# Altium schematic sheet GateDriver.SchDoc
size A4; SheetNumber: 2; SheetTotal: 3
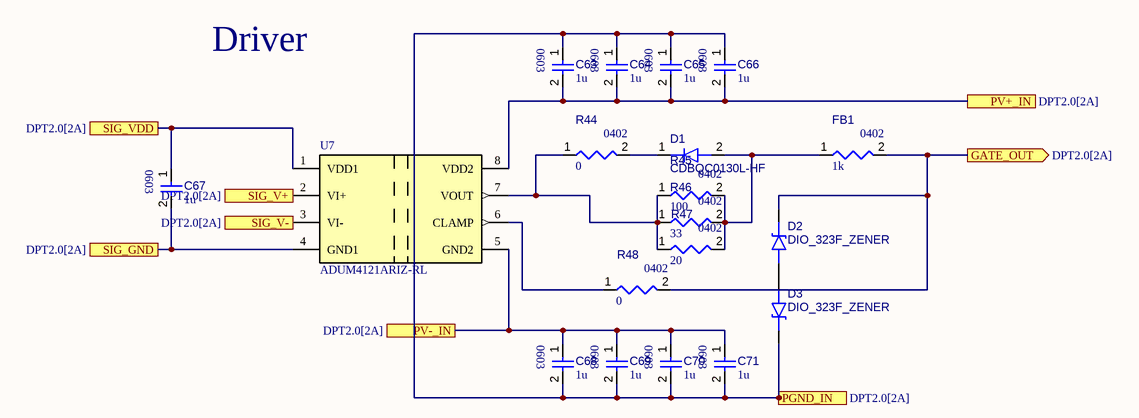
[diagram p0: GateDriver.SchDoc]

## Parts
C63  value 1u  [CAP_0603_HIGH]  (hidden comment: CAP-0603)
C64  value 1u  [CAP_0603_HIGH]  (hidden comment: CAP-0603)
C65  value 1u  [CAP_0603_HIGH]  (hidden comment: CAP-0603)
C66  value 1u  [CAP_0603_HIGH]  (hidden comment: CAP-0603)
C67  value 1u  [CAP_0603_HIGH]  (hidden comment: CAP-0603)
C68  value 1u  [CAP_0603_HIGH]  (hidden comment: CAP-0603)
C69  value 1u  [CAP_0603_HIGH]  (hidden comment: CAP-0603)
C70  value 1u  [CAP_0603_HIGH]  (hidden comment: CAP-0603)
C71  value 1u  [CAP_0603_HIGH]  (hidden comment: CAP-0603)
D1  CDBQC0130L-HF  [DIO_SOD-923F]
D2  DIO_323F_ZENER  [DIO_SOD-323F]
D3  DIO_323F_ZENER  [DIO_SOD-323F]
FB1  value 1k  [RES_0402_HIGH]  (hidden comment: RES-0402)
R44  value 0  [RES_0402_HIGH]  (hidden comment: RES-0402)
R45  value 100  [RES_0402_HIGH]  (hidden comment: RES-0402)
R46  value 33  [RES_0402_HIGH]  (hidden comment: RES-0402)
R47  value 20  [RES_0402_HIGH]  (hidden comment: RES-0402)
R48  value 0  [RES_0402_HIGH]  (hidden comment: RES-0402)
U7  ADUM4121ARIZ-RL  [SOIC-8_WIDE]

## Ports
GATE_OUT (out, see DPT2.0[2A]), PGND_IN (see DPT2.0[2A]), PV+_IN (see DPT2.0[2A]), PV-_IN (see DPT2.0[2A]), SIG_GND (see DPT2.0[2A]), SIG_V+ (in, see DPT2.0[2A]), SIG_V- (in, see DPT2.0[2A]), SIG_VDD (see DPT2.0[2A])

## Nets
GATE_OUT: D2.1(K) FB1.2 R48.2 ; port GATE_OUT
PGND_IN: C63.1 C64.1 C65.1 C66.1 C68.2 C69.2 C70.2 C71.2 D3.1(K) ; port PGND_IN
PV+_IN: C63.2 C64.2 C65.2 C66.2 U7.8(VDD2) ; port PV+_IN
PV-_IN: C68.1 C69.1 C70.1 C71.1 U7.5(GND2) ; port PV-_IN
SIG_GND: C67.2 U7.4(GND1) ; port SIG_GND
SIG_V+: U7.2(VI+) ; port SIG_V+
SIG_V-: U7.3(VI-) ; port SIG_V-
SIG_VDD: C67.1 U7.1(VDD1) ; port SIG_VDD
NetD1_1: D1.1(K) R44.2
NetD1_2: D1.2(A) FB1.1 R45.2 R46.2 R47.2
NetD2_2: D2.2(A) D3.2(A)
NetR44_1: R44.1 R45.1 R46.1 R47.1 U7.7(VOUT)
NetR48_1: R48.1 U7.6(CLAMP)

## Notes on the sheet
- Driver

## Library data of the parts
C63-C71 = CMP-001-00084-2: Non polarized SMD capacitor - 0603 (1608 Metric); Package: 0603
D1 = CMP-004-00031-2: Low VF SMD Schottky Barrier Diode; Package: SOD-923F
D2 D3 = CMP-004-00032-1: Generic SOD-323F Zener diode; Value: 6.2V; Package: SOD-323F
FB1 R44-R48 = CMP-009-00177-2: SMD Resistor - 0402 (1005 Metric); Package: 0402
U7 = CMP-019-000000-4: DGTL ISO 5KV 1CH GATE DRVR 8SOIC; Package: 8-SOIC WIDE